# Altium schematic sheet 11_MCU.SchDoc
size 420 x 297 mm; SheetNumber: 20; SheetTotal: 33
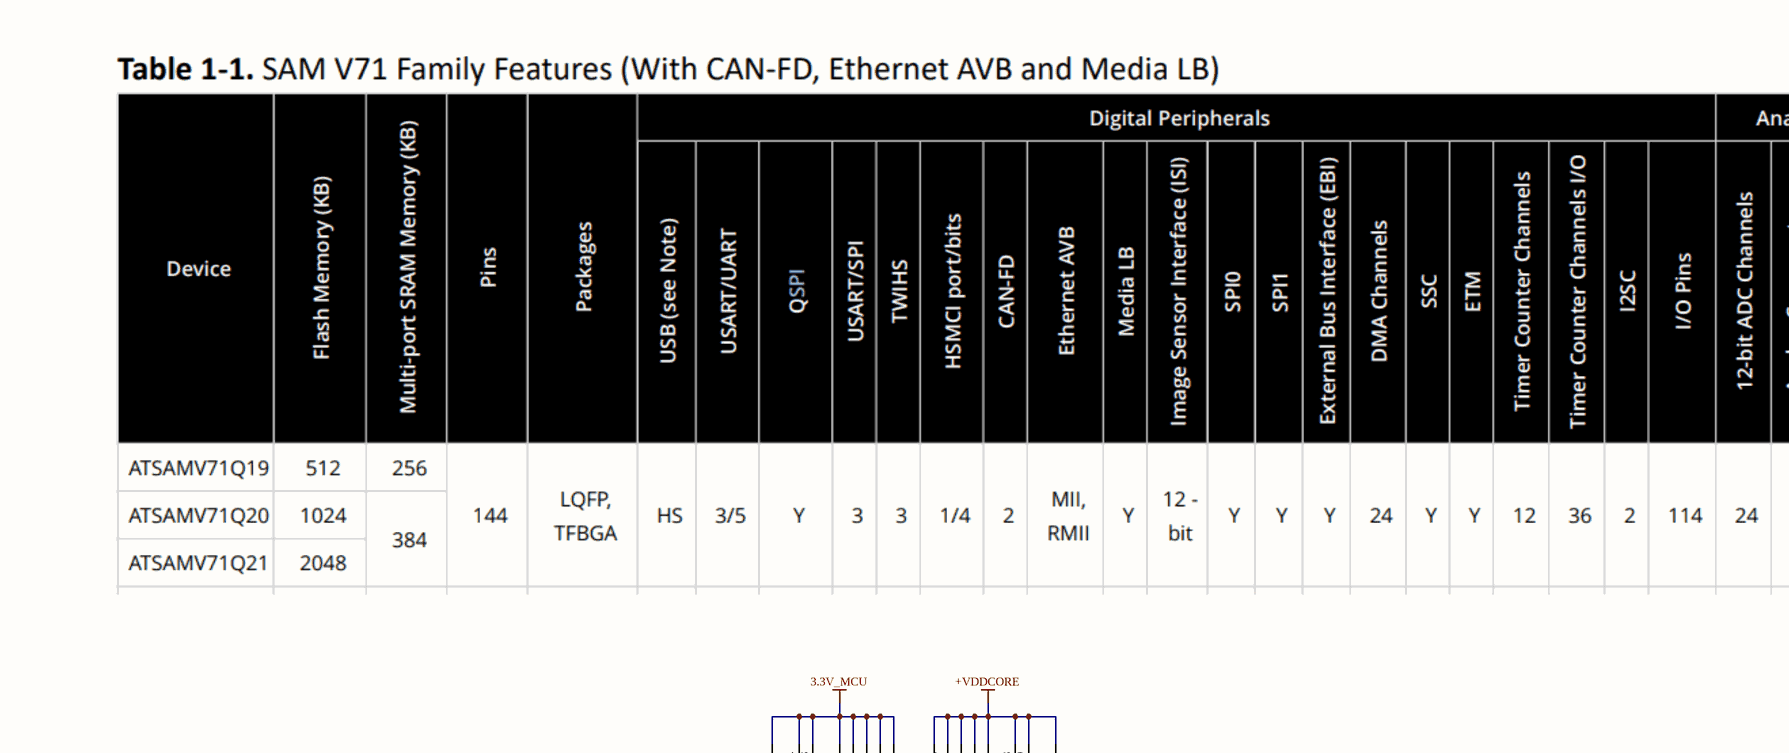
[diagram p0: 11_MCU.SchDoc, top left]
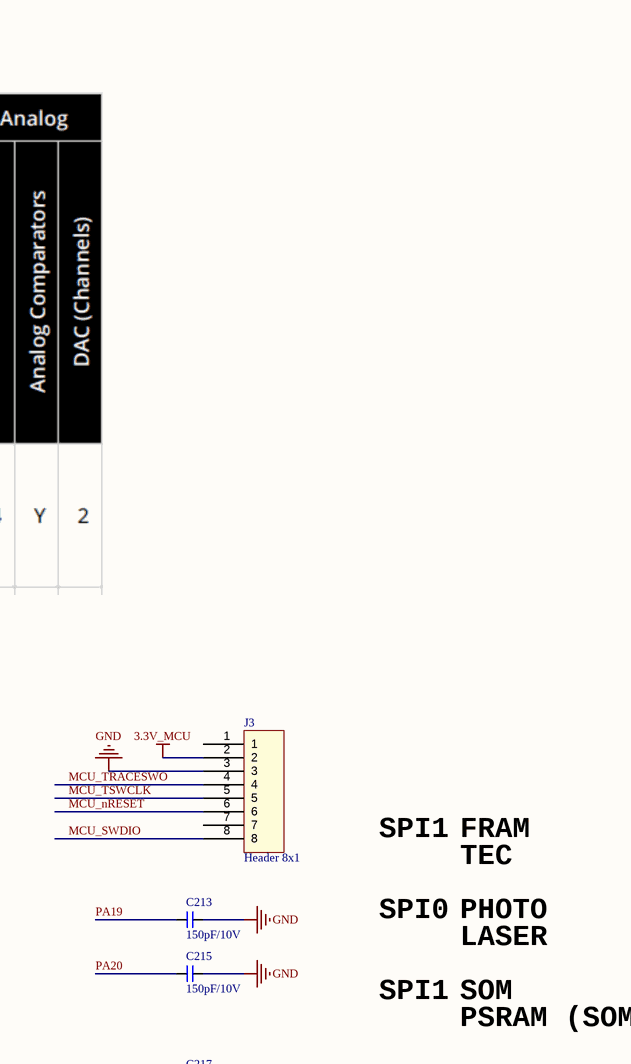
[diagram p1: 11_MCU.SchDoc, top right]
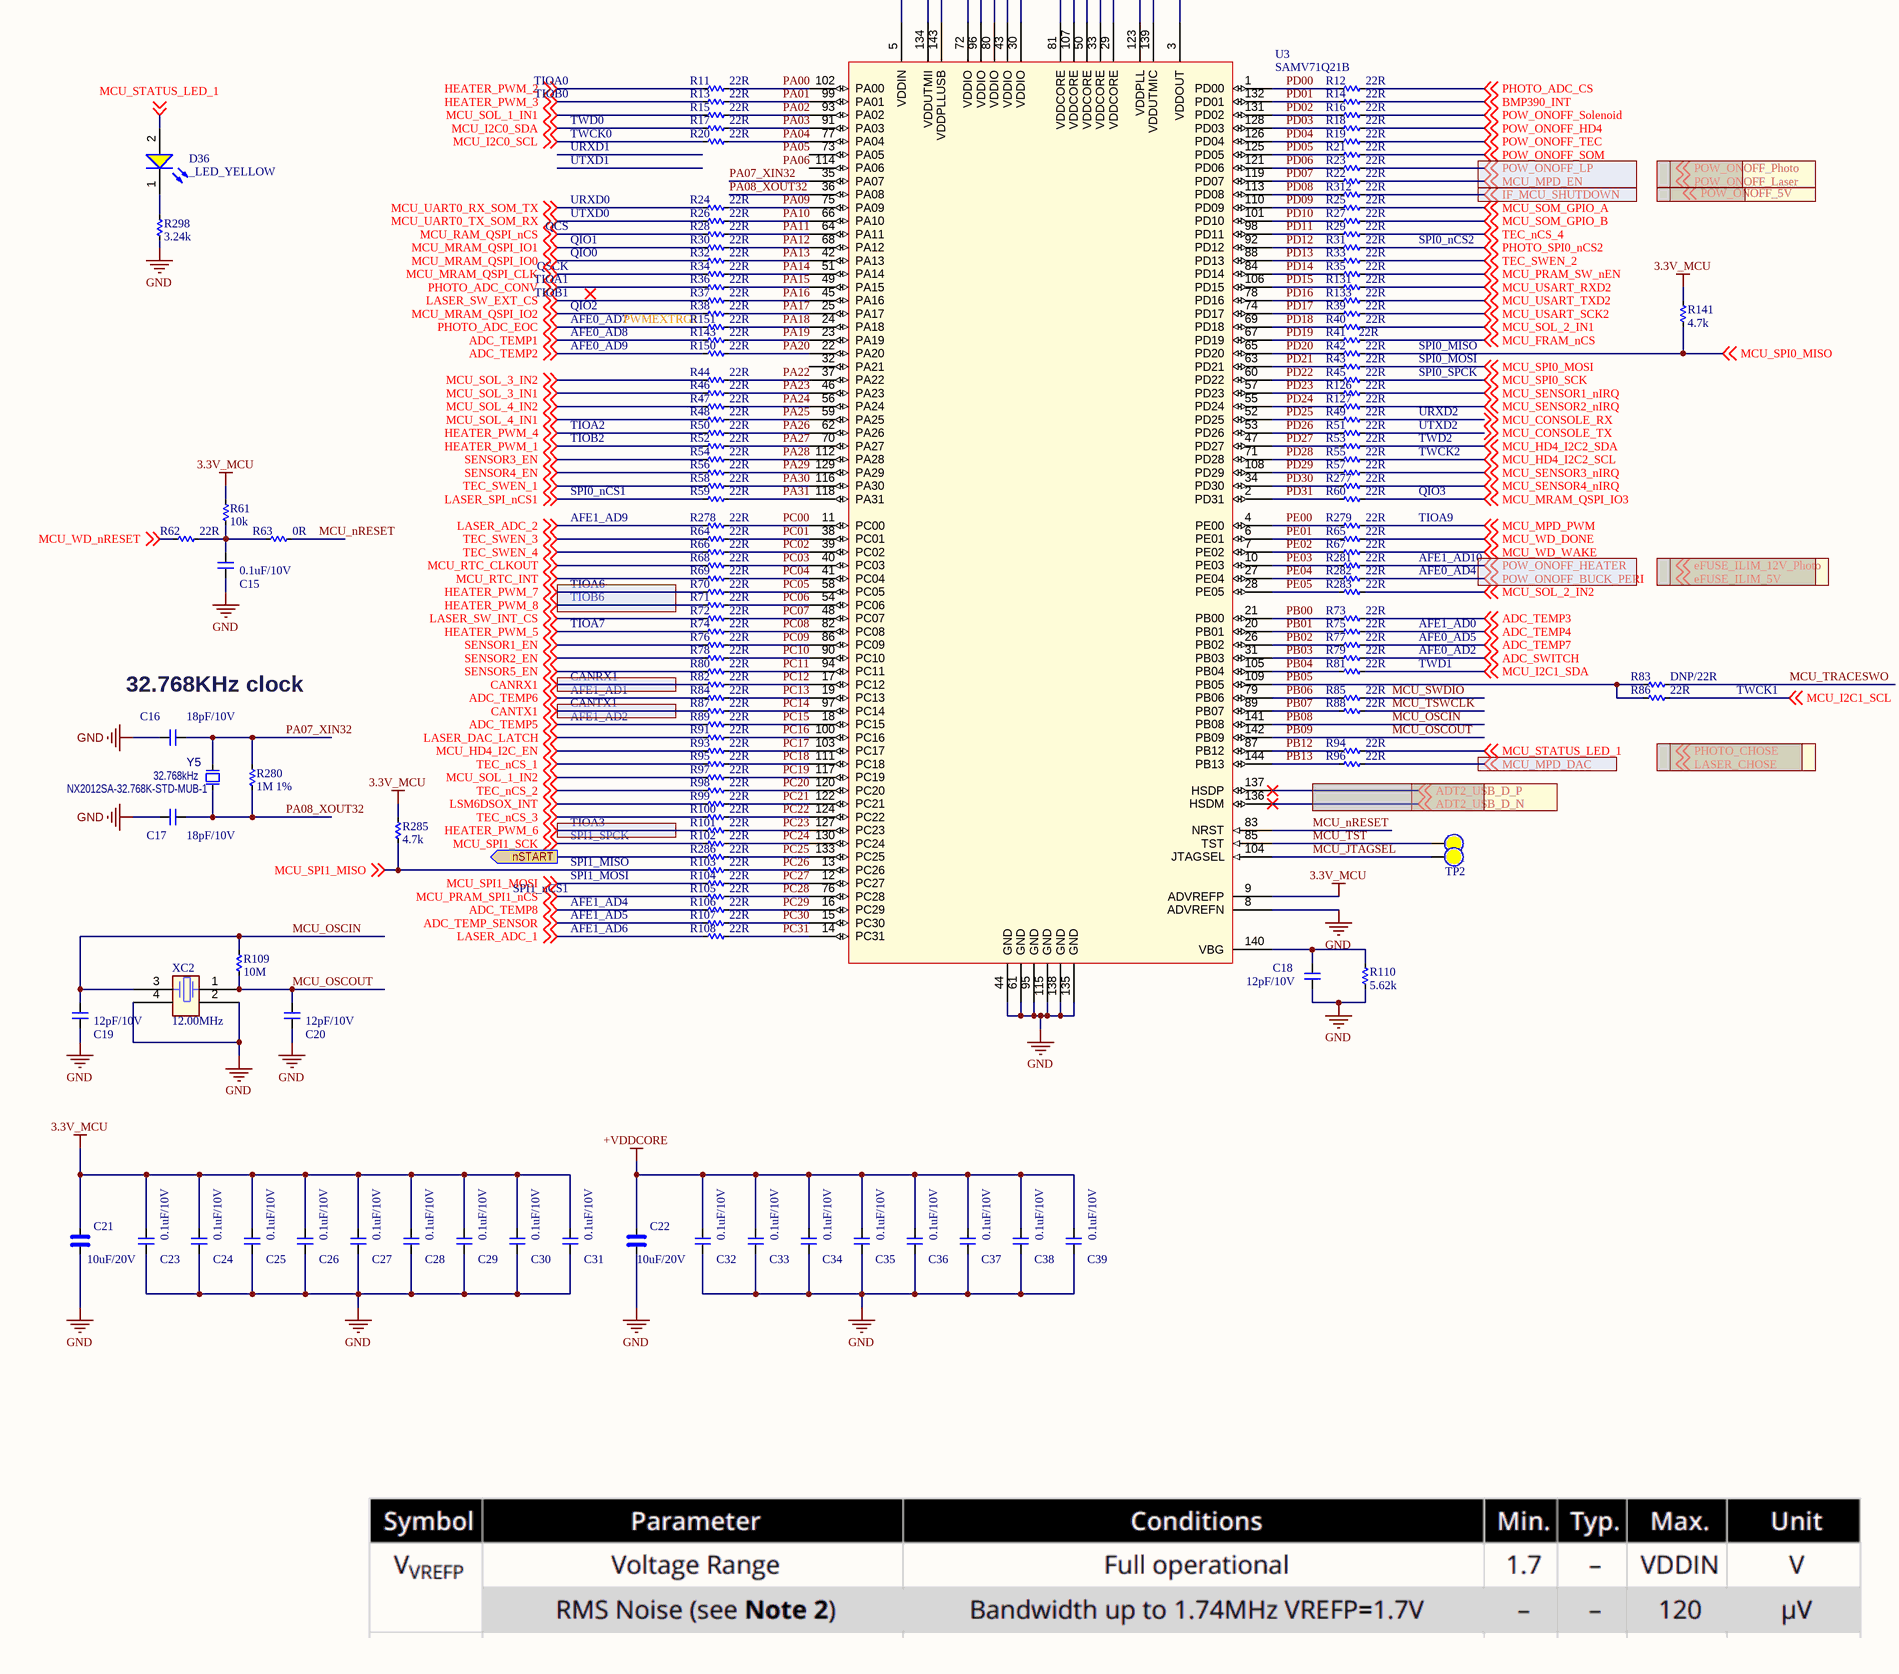
[diagram p2: 11_MCU.SchDoc, bottom left]
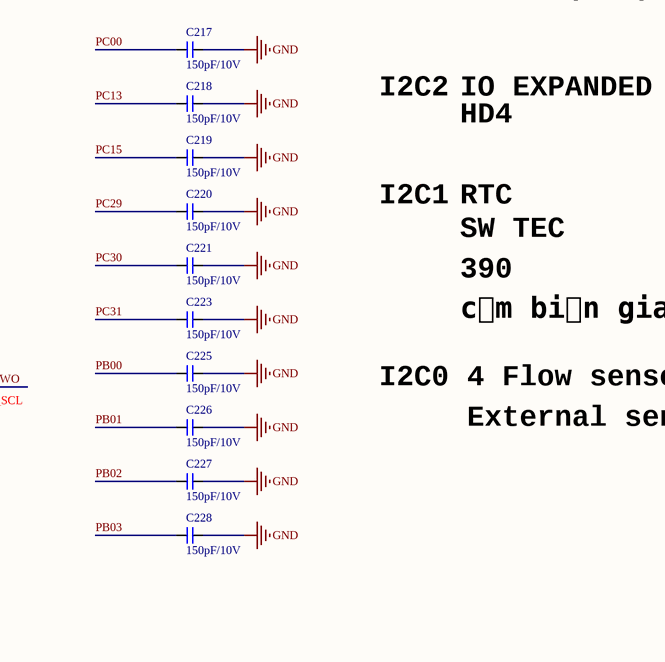
[diagram p3: 11_MCU.SchDoc, bottom right]

## Parts
C15  0.1uF/10V  [CAP_C_1005X50_L]
C16  18pF/10V  [CAP_C_0603x30]
C17  18pF/10V  [CAP_C_0603x30]
C18  12pF/10V  [CAP_C_1005X50_L]
C19  12pF/10V  [CAP_C_1005X50_L]
C20  12pF/10V  [CAP_C_1005X50_L]
C21  10uF/20V  [CAP_C_2012X110]
C22  10uF/20V  [CAP_C_2012X110]
C23  0.1uF/10V  [CAP_C_1005X50_L]
C24  0.1uF/10V  [CAP_C_1005X50_L]
C25  0.1uF/10V  [CAP_C_1005X50_L]
C26  0.1uF/10V  [CAP_C_1005X50_L]
C27  0.1uF/10V  [CAP_C_1005X50_L]
C28  0.1uF/10V  [CAP_C_1005X50_L]
C29  0.1uF/10V  [CAP_C_1005X50_L]
C30  0.1uF/10V  [CAP_C_1005X50_L]
C31  0.1uF/10V  [CAP_C_1005X50_L]
C32  0.1uF/10V  [CAP_C_1005X50_L]
C33  0.1uF/10V  [CAP_C_1005X50_L]
C34  0.1uF/10V  [CAP_C_1005X50_L]
C35  0.1uF/10V  [CAP_C_1005X50_L]
C36  0.1uF/10V  [CAP_C_1005X50_L]
C37  0.1uF/10V  [CAP_C_1005X50_L]
C38  0.1uF/10V  [CAP_C_1005X50_L]
C39  0.1uF/10V  [CAP_C_1005X50_L]
C213  150pF/10V  [CAP_C_0603x30]
C215  150pF/10V  [CAP_C_0603x30]
C217  150pF/10V  [CAP_C_0603x30]
C218  150pF/10V  [CAP_C_0603x30]
C219  150pF/10V  [CAP_C_0603x30]
C220  150pF/10V  [CAP_C_0603x30]
C221  150pF/10V  [CAP_C_0603x30]
C223  150pF/10V  [CAP_C_0603x30]
C225  150pF/10V  [CAP_C_0603x30]
C226  150pF/10V  [CAP_C_0603x30]
C227  150pF/10V  [CAP_C_0603x30]
C228  150pF/10V  [CAP_C_0603x30]
D36  _LED_YELLOW  [LED_0402]
J3  Header 8x1  [SAMTEC_TSM-108-01-L-SV-P-TR]
R11  22R  [RES_C_0603X30]
R12  22R  [RES_C_0603X30]
R13  22R  [RES_C_0603X30]
R14  22R  [RES_C_0603X30]
R15  22R  [RES_C_0603X30]
R16  22R  [RES_C_0603X30]
R17  22R  [RES_C_0603X30]
R18  22R  [RES_C_0603X30]
R19  22R  [RES_C_0603X30]
R20  22R  [RES_C_0603X30]
R21  22R  [RES_C_0603X30]
R22  22R  [RES_C_0603X30]
R23  22R  [RES_C_0603X30]
R24  22R  [RES_C_0603X30]
R25  22R  [RES_C_0603X30]
R26  22R  [RES_C_0603X30]
R27  22R  [RES_C_0603X30]
R28  22R  [RES_C_0603X30]
R29  22R  [RES_C_0603X30]
R30  22R  [RES_C_0603X30]
R31  22R  [RES_C_0603X30]
R32  22R  [RES_C_0603X30]
R33  22R  [RES_C_0603X30]
R34  22R  [RES_C_0603X30]
R35  22R  [RES_C_0603X30]
R36  22R  [RES_C_0603X30]
R37  22R  [RES_C_0603X30]
R38  22R  [RES_C_0603X30]
R39  22R  [RES_C_0603X30]
R40  22R  [RES_C_0603X30]
R41  22R  [RES_C_0603X30]
R42  22R  [RES_C_0603X30]
R43  22R  [RES_C_0603X30]
R44  22R  [RES_C_0603X30]
R45  22R  [RES_C_0603X30]
R46  22R  [RES_C_0603X30]
R47  22R  [RES_C_0603X30]
R48  22R  [RES_C_0603X30]
R49  22R  [RES_C_0603X30]
R50  22R  [RES_C_0603X30]
R51  22R  [RES_C_0603X30]
R52  22R  [RES_C_0603X30]
R53  22R  [RES_C_0603X30]
R54  22R  [RES_C_0603X30]
R55  22R  [RES_C_0603X30]
R56  22R  [RES_C_0603X30]
R57  22R  [RES_C_0603X30]
R58  22R  [RES_C_0603X30]
R59  22R  [RES_C_0603X30]
R60  22R  [RES_C_0603X30]
R61  10k  [RES_C_1005x30_L]
R62  22R  [RES_C_1005x30_L]
R63  0R  [RES_C_0603X30]
R64  22R  [RES_C_0603X30]
R65  22R  [RES_C_0603X30]
R66  22R  [RES_C_0603X30]
R67  22R  [RES_C_0603X30]
R68  22R  [RES_C_0603X30]
R69  22R  [RES_C_0603X30]
R70  22R  [RES_C_0603X30]
R71  22R  [RES_C_0603X30]
R72  22R  [RES_C_0603X30]
R73  22R  [RES_C_0603X30]
R74  22R  [RES_C_0603X30]
R75  22R  [RES_C_0603X30]
R76  22R  [RES_C_0603X30]
R77  22R  [RES_C_0603X30]
R78  22R  [RES_C_0603X30]
R79  22R  [RES_C_0603X30]
R80  22R  [RES_C_0603X30]
R81  22R  [RES_C_0603X30]
R82  22R  [RES_C_0603X30]
R83  DNP/22R  [RES_C_0603X30]
R84  22R  [RES_C_0603X30]
R85  22R  [RES_C_0603X30]
R86  22R  [RES_C_0603X30]
R87  22R  [RES_C_0603X30]
R88  22R  [RES_C_0603X30]
R89  22R  [RES_C_0603X30]
R91  22R  [RES_C_0603X30]
R93  22R  [RES_C_0603X30]
R94  22R  [RES_C_0603X30]
R95  22R  [RES_C_0603X30]
R96  22R  [RES_C_0603X30]
R97  22R  [RES_C_0603X30]
R98  22R  [RES_C_0603X30]
R99  22R  [RES_C_0603X30]
R100  22R  [RES_C_0603X30]
R101  22R  [RES_C_0603X30]
R102  22R  [RES_C_0603X30]
R103  22R  [RES_C_0603X30]
R104  22R  [RES_C_0603X30]
R105  22R  [RES_C_0603X30]
R106  22R  [RES_C_0603X30]
R107  22R  [RES_C_0603X30]
R108  22R  [RES_C_0603X30]
R109  10M  [RES_C_1005x30_L]
R110  5.62k  [RES_C_1005x30_L]
R126  22R  [RES_C_0603X30]
R127  22R  [RES_C_0603X30]
R131  22R  [RES_C_0603X30]
R133  22R  [RES_C_0603X30]
R141  4.7k  [RES_C_0603X30]
R143  22R  [RES_C_0603X30]
R150  22R  [RES_C_0603X30]
R151  22R  [RES_C_0603X30]
R277  22R  [RES_C_0603X30]
R278  22R  [RES_C_0603X30]
R279  22R  [RES_C_0603X30]
R280  1M 1%  [RES_C_1005x30_L]
R281  22R  [RES_C_0603X30]
R282  22R  [RES_C_0603X30]
R283  22R  [RES_C_0603X30]
R285  4.7k  [RES_C_0603X30]
R286  22R  [RES_C_0603X30]
R298  3.24k  [RES_C_1005x30_L]
R312  22R  [RES_C_0603X30]
TP1  (no value)  [TP_1mm_SMD]  (no BOM)
TP2  (no value)  [TP_1mm_SMD]  (no BOM)
U3  SAMV71Q21B  [AP6-00118]
XC2  value 12.00MHz  [AP7-00039]  (hidden comment: FC5BQCCMC12.0-T1)
Y5  value 32.768kHz  Manufacturer Part Number 1: NX2012SA-32.768K-STD-MUB-1  [CRYSTAL_NX2012SA]  (hidden comment: Crystal 2 Pins)

## Ports
nSTART (out)

## Nets
3.3V_MCU: C21.1 C23.2 C24.2 C25.2 C26.2 C27.2 C28.2 C29.2 C30.2 C31.2 J3.2 R61.2 R141.1 R285.1 U3.5(VDDIN) U3.9(ADVREFP) U3.30(VDDIO) U3.43(VDDIO) U3.72(VDDIO) U3.80(VDDIO) U3.96(VDDIO) U3.134(VDDUTMII) U3.143(VDDPLLUSB)
+VDDCORE: C22.1 C32.2 C33.2 C34.2 C35.2 C36.2 C37.2 C38.2 C39.2 U3.3(VDDOUT) U3.29(VDDCORE) U3.33(VDDCORE) U3.50(VDDCORE) U3.81(VDDCORE) U3.107(VDDCORE) U3.123(VDDPLL) U3.139(VDDUTMIC)
GND: C15.1 C16.2 C17.2 C18.1 C19.1 C20.1 C21.2 C22.2 C23.1 C24.1 C25.1 C26.1 C27.1 C28.1 C29.1 C30.1 C31.1 C32.1 C33.1 C34.1 C35.1 C36.1 C37.1 C38.1 C39.1 C213.1 C215.1 C217.1 C218.1 C219.1 C220.1 C221.1 C223.1 C225.1 C226.1 C227.1 C228.1 J3.3 R110.1 R298.2 U3.8(ADVREFN) U3.44(GND) U3.61(GND) U3.95(GND) U3.115(GND) U3.135(GND) U3.138(GND) XC2.2 XC2.4
ADC_SWITCH: R79.1 ; off-sheet ADC_SWITCH
ADC_TEMP1: R143.2 ; off-sheet ADC_TEMP1
ADC_TEMP2: R150.2 ; off-sheet ADC_TEMP2
ADC_TEMP3: R73.1 ; off-sheet ADC_TEMP3
ADC_TEMP4: R75.1 ; off-sheet ADC_TEMP4
ADC_TEMP5: R89.2 ; off-sheet ADC_TEMP5
ADC_TEMP6: R84.2 ; off-sheet ADC_TEMP6
ADC_TEMP7: R77.1 ; off-sheet ADC_TEMP7
ADC_TEMP8: R106.2 ; off-sheet ADC_TEMP8
ADC_TEMP_SENSOR: R107.2 ; off-sheet ADC_TEMP_SENSOR
BMP390_INT: R14.1 ; off-sheet BMP390_INT
CANRX1: R82.2 ; off-sheet CANRX1
CANTX1: R87.2 ; off-sheet CANTX1
HEATER_PWM_1: R52.2 ; off-sheet HEATER_PWM_1
HEATER_PWM_2: R11.2 ; off-sheet HEATER_PWM_2
HEATER_PWM_3: R13.2 ; off-sheet HEATER_PWM_3
HEATER_PWM_4: R50.2 ; off-sheet HEATER_PWM_4
HEATER_PWM_5: R74.2 ; off-sheet HEATER_PWM_5
HEATER_PWM_6: R101.2 ; off-sheet HEATER_PWM_6
HEATER_PWM_7: R70.2 ; off-sheet HEATER_PWM_7
HEATER_PWM_8: R71.2 ; off-sheet HEATER_PWM_8
IF_MCU_SHUTDOWN: R312.1 ; off-sheet IF_MCU_SHUTDOWN
LASER_ADC_1: R108.2 ; off-sheet LASER_ADC_1
LASER_ADC_2: R278.2 ; off-sheet LASER_ADC_2
LASER_DAC_LATCH: R91.2 ; off-sheet LASER_DAC_LATCH
LASER_SPI_nCS1: R59.2 ; off-sheet LASER_SPI_nCS1
LASER_SW_EXT_CS: R37.2 ; off-sheet LASER_SW_EXT_CS
LASER_SW_INT_CS: R72.2 ; off-sheet LASER_SW_INT_CS
LSM6DSOX_INT: R99.2 ; off-sheet LSM6DSOX_INT
MCU_CONSOLE_RX: R49.1 ; off-sheet MCU_CONSOLE_RX
MCU_CONSOLE_TX: R51.1 ; off-sheet MCU_CONSOLE_TX
MCU_FRAM_nCS: R41.2 ; off-sheet MCU_FRAM_nCS
MCU_HD4_I2C2_SCL: R55.1 ; off-sheet MCU_HD4_I2C2_SCL
MCU_HD4_I2C2_SDA: R53.1 ; off-sheet MCU_HD4_I2C2_SDA
MCU_HD4_I2C_EN: R93.2 ; off-sheet MCU_HD4_I2C_EN
MCU_I2C0_SCL: R20.2 ; off-sheet MCU_I2C0_SCL
MCU_I2C0_SDA: R17.2 ; off-sheet MCU_I2C0_SDA
MCU_I2C1_SCL: R86.1 ; off-sheet MCU_I2C1_SCL
MCU_I2C1_SDA: R81.1 ; off-sheet MCU_I2C1_SDA
MCU_JTAGSEL: TP2.0 U3.104(JTAGSEL)
MCU_MPD_DAC: R96.1 ; off-sheet MCU_MPD_DAC
MCU_MPD_EN: R22.1 ; off-sheet MCU_MPD_EN
MCU_MPD_PWM: R279.1 ; off-sheet MCU_MPD_PWM
MCU_MRAM_QSPI_CLK: R34.2 ; off-sheet MCU_MRAM_QSPI_CLK
MCU_MRAM_QSPI_IO0: R32.2 ; off-sheet MCU_MRAM_QSPI_IO0
MCU_MRAM_QSPI_IO1: R30.2 ; off-sheet MCU_MRAM_QSPI_IO1
MCU_MRAM_QSPI_IO2: R38.2 ; off-sheet MCU_MRAM_QSPI_IO2
MCU_MRAM_QSPI_IO3: R60.1 ; off-sheet MCU_MRAM_QSPI_IO3
MCU_nRESET: J3.6 R63.1 U3.83(NRST)
MCU_OSCIN: C19.2 R109.2 U3.141(PB08) XC2.3  [also labelled PB08]
MCU_OSCOUT: C20.2 R109.1 U3.142(PB09) XC2.1  [also labelled PB09]
MCU_PRAM_SPI1_nCS: R105.2 ; off-sheet MCU_PRAM_SPI1_nCS
MCU_PRAM_SW_nEN: R35.1 ; off-sheet MCU_PRAM_SW_nEN
MCU_RAM_QSPI_nCS: R28.2 ; off-sheet MCU_RAM_QSPI_nCS
MCU_RTC_CLKOUT: R68.2 ; off-sheet MCU_RTC_CLKOUT
MCU_RTC_INT: R69.2 ; off-sheet MCU_RTC_INT
MCU_SENSOR1_nIRQ: R126.1 ; off-sheet MCU_SENSOR1_nIRQ
MCU_SENSOR2_nIRQ: R127.1 ; off-sheet MCU_SENSOR2_nIRQ
MCU_SENSOR3_nIRQ: R57.2 ; off-sheet MCU_SENSOR3_nIRQ
MCU_SENSOR4_nIRQ: R277.2 ; off-sheet MCU_SENSOR4_nIRQ
MCU_SOL_1_IN1: R15.2 ; off-sheet MCU_SOL_1_IN1
MCU_SOL_1_IN2: R97.2 ; off-sheet MCU_SOL_1_IN2
MCU_SOL_2_IN1: R40.1 ; off-sheet MCU_SOL_2_IN1
MCU_SOL_2_IN2: R283.1 ; off-sheet MCU_SOL_2_IN2
MCU_SOL_3_IN1: R46.2 ; off-sheet MCU_SOL_3_IN1
MCU_SOL_3_IN2: R44.2 ; off-sheet MCU_SOL_3_IN2
MCU_SOL_4_IN1: R48.2 ; off-sheet MCU_SOL_4_IN1
MCU_SOL_4_IN2: R47.2 ; off-sheet MCU_SOL_4_IN2
MCU_SOM_GPIO_A: R25.1 ; off-sheet MCU_SOM_GPIO_A
MCU_SOM_GPIO_B: R27.1 ; off-sheet MCU_SOM_GPIO_B
MCU_SPI0_MISO: R42.1 R141.2 ; off-sheet MCU_SPI0_MISO
MCU_SPI0_MOSI: R43.1 ; off-sheet MCU_SPI0_MOSI
MCU_SPI0_SCK: R45.1 ; off-sheet MCU_SPI0_SCK
MCU_SPI1_MISO: R103.2 R285.2 ; off-sheet MCU_SPI1_MISO
MCU_SPI1_MOSI: R104.2 ; off-sheet MCU_SPI1_MOSI
MCU_SPI1_SCK: R102.2 ; off-sheet MCU_SPI1_SCK
MCU_STATUS_LED_1: D36.2(A) R94.1 ; off-sheet MCU_STATUS_LED_1
MCU_SWDIO: J3.8 R85.1
MCU_TRACESWO: J3.4 R83.1
MCU_TST: TP1.0 U3.85(TST)
MCU_TSWCLK: J3.5 R88.1
MCU_UART0_RX_SOM_TX: R24.2 ; off-sheet MCU_UART0_RX_SOM_TX
MCU_UART0_TX_SOM_RX: R26.2 ; off-sheet MCU_UART0_TX_SOM_RX
MCU_USART_RXD2: R131.1 ; off-sheet MCU_USART_RXD2
MCU_USART_SCK2: R39.1 ; off-sheet MCU_USART_SCK2
MCU_USART_TXD2: R133.1 ; off-sheet MCU_USART_TXD2
MCU_WD_DONE: R65.1 ; off-sheet MCU_WD_DONE
MCU_WD_nRESET: R62.2 ; off-sheet MCU_WD_nRESET
MCU_WD_WAKE: R67.1 ; off-sheet MCU_WD_WAKE
nSTART: R286.2 ; port nSTART
PA00: R11.1 U3.102(PA00)
PA01: R13.1 U3.99(PA01)
PA02: R15.1 U3.93(PA02)
PA03: R17.1 U3.91(PA03)
PA04: R20.1 U3.77(PA04)
PA07_XIN32: C16.1 R280.1 U3.35(PA07) Y5.2(Osc2)
PA08_XOUT32: C17.1 R280.2 U3.36(PA08) Y5.1(Osc1)
PA09: R24.1 U3.75(PA09)
PA10: R26.1 U3.66(PA10)
PA11: R28.1 U3.64(PA11)
PA12: R30.1 U3.68(PA12)
PA13: R32.1 U3.42(PA13)
PA14: R34.1 U3.51(PA14)
PA15: R36.1 U3.49(PA15)
PA16: R37.1 U3.45(PA16)
PA17: R38.1 U3.25(PA17)
PA18: R151.1 U3.24(PA18)
PA19: C213.2 R143.1 U3.23(PA19)
PA20: C215.2 R150.1 U3.22(PA20)
PA22: R44.1 U3.37(PA22)
PA23: R46.1 U3.46(PA23)
PA24: R47.1 U3.56(PA24)
PA25: R48.1 U3.59(PA25)
PA26: R50.1 U3.62(PA26)
PA27: R52.1 U3.70(PA27)
PA28: R54.1 U3.112(PA28)
PA29: R56.1 U3.129(PA29)
PA30: R58.1 U3.116(PA30)
PA31: R59.1 U3.118(PA31)
PB00: C225.2 R73.2 U3.21(PB00)
PB01: C226.2 R75.2 U3.20(PB01)
PB02: C227.2 R77.2 U3.26(PB02)
PB03: C228.2 R79.2 U3.31(PB03)
PB04: R81.2 U3.105(PB04)
PB05: R83.2 R86.2 U3.109(PB05)
PB06: R85.2 U3.79(PB06)
PB07: R88.2 U3.89(PB07)
PB12: R94.2 U3.87(PB12)
PB13: R96.2 U3.144(PB13)
PC00: C217.2 R278.1 U3.11(PC00)
PC01: R64.1 U3.38(PC01)
PC02: R66.1 U3.39(PC02)
PC03: R68.1 U3.40(PC03)
PC04: R69.1 U3.41(PC04)
PC05: R70.1 U3.58(PC05)
PC06: R71.1 U3.54(PC06)
PC07: R72.1 U3.48(PC07)
PC08: R74.1 U3.82(PC08)
PC09: R76.1 U3.86(PC09)
PC10: R78.1 U3.90(PC10)
PC11: R80.1 U3.94(PC11)
PC12: R82.1 U3.17(PC12)
PC13: C218.2 R84.1 U3.19(PC13)
PC14: R87.1 U3.97(PC14)
PC15: C219.2 R89.1 U3.18(PC15)
PC16: R91.1 U3.100(PC16)
PC17: R93.1 U3.103(PC17)
PC18: R95.1 U3.111(PC18)
PC19: R97.1 U3.117(PC19)
PC20: R98.1 U3.120(PC20)
PC21: R99.1 U3.122(PC21)
PC22: R100.1 U3.124(PC22)
PC23: R101.1 U3.127(PC23)
PC24: R102.1 U3.130(PC24)
PC25: R286.1 U3.133(PC25)
PC26: R103.1 U3.13(PC26)
PC27: R104.1 U3.12(PC27)
PC28: R105.1 U3.76(PC28)
PC29: C220.2 R106.1 U3.16(PC29)
PC30: C221.2 R107.1 U3.15(PC30)
PC31: C223.2 R108.1 U3.14(PC31)
PD00: R12.2 U3.1(PD00)
PD01: R14.2 U3.132(PD01)
PD02: R16.2 U3.131(PD02)
PD03: R18.2 U3.128(PD03)
PD04: R19.2 U3.126(PD04)
PD05: R21.2 U3.125(PD05)
PD06: R23.2 U3.121(PD06)
PD07: R22.2 U3.119(PD07)
PD08: R312.2 U3.113(PD08)
PD09: R25.2 U3.110(PD09)
PD10: R27.2 U3.101(PD10)
PD11: R29.2 U3.98(PD11)
PD12: R31.2 U3.92(PD12)
PD13: R33.2 U3.88(PD13)
PD14: R35.2 U3.84(PD14)
PD15: R131.2 U3.106(PD15)
PD16: R133.2 U3.78(PD16)
PD17: R39.2 U3.74(PD17)
PD18: R40.2 U3.69(PD18)
PD19: R41.1 U3.67(PD19)
PD20: R42.2 U3.65(PD20)
PD21: R43.2 U3.63(PD21)
PD22: R45.2 U3.60(PD22)
PD23: R126.2 U3.57(PD23)
PD24: R127.2 U3.55(PD24)
PD25: R49.2 U3.52(PD25)
PD26: R51.2 U3.53(PD26)
PD27: R53.2 U3.47(PD27)
PD28: R55.2 U3.71(PD28)
PD29: R57.1 U3.108(PD29)
PD30: R277.1 U3.34(PD30)
PD31: R60.2 U3.2(PD31)
PE00: R279.2 U3.4(PE00)
PE01: R65.2 U3.6(PE01)
PE02: R67.2 U3.7(PE02)
PE03: R281.2 U3.10(PE03)
PE04: R282.2 U3.27(PE04)
PE05: R283.2 U3.28(PE05)
PHOTO_ADC_CONV: R36.2 ; off-sheet PHOTO_ADC_CONV
PHOTO_ADC_CS: R12.1 ; off-sheet PHOTO_ADC_CS
PHOTO_ADC_EOC: R151.2 ; off-sheet PHOTO_ADC_EOC
PHOTO_SPI0_nCS2: R31.1 ; off-sheet PHOTO_SPI0_nCS2
POW_ONOFF_BUCK_PERI: R282.1 ; off-sheet POW_ONOFF_BUCK_PERI
POW_ONOFF_HD4: R18.1 ; off-sheet POW_ONOFF_HD4
POW_ONOFF_HEATER: R281.1 ; off-sheet POW_ONOFF_HEATER
POW_ONOFF_LP: R23.1 ; off-sheet POW_ONOFF_LP
POW_ONOFF_Solenoid: R16.1 ; off-sheet POW_ONOFF_Solenoid
POW_ONOFF_SOM: R21.1 ; off-sheet POW_ONOFF_SOM
POW_ONOFF_TEC: R19.1 ; off-sheet POW_ONOFF_TEC
SENSOR1_EN: R76.2 ; off-sheet SENSOR1_EN
SENSOR2_EN: R78.2 ; off-sheet SENSOR2_EN
SENSOR3_EN: R54.2 ; off-sheet SENSOR3_EN
SENSOR4_EN: R56.2 ; off-sheet SENSOR4_EN
SENSOR5_EN: R80.2 ; off-sheet SENSOR5_EN
TEC_nCS_1: R95.2 ; off-sheet TEC_nCS_1
TEC_nCS_2: R98.2 ; off-sheet TEC_nCS_2
TEC_nCS_3: R100.2 ; off-sheet TEC_nCS_3
TEC_nCS_4: R29.1 ; off-sheet TEC_nCS_4
TEC_SWEN_1: R58.2 ; off-sheet TEC_SWEN_1
TEC_SWEN_2: R33.1 ; off-sheet TEC_SWEN_2
TEC_SWEN_3: R64.2 ; off-sheet TEC_SWEN_3
TEC_SWEN_4: R66.2 ; off-sheet TEC_SWEN_4
NetC15_2: C15.2 R61.1 R62.1 R63.2
NetC18_2: C18.2 R110.2 U3.140(VBG)
NetD36_1: D36.1(K) R298.1

Not connected (* = marked no-connect by the designer): J3 1 7; U3 32(PA21) 73(PA05) 114(PA06) 136(HSDM)* 137(HSDP)*

## Notes on the sheet
- TIOA0
- URXD1
- TWD0
- TWCK0
- TIOB0
- SPI1
- TEC
- FRAM
- UTXD1
- URXD0
- UTXD0
- SPI0
- PHOTO
- QIO1
- QCS
- QSCK
- QIO0
- TIOA1
- SPI0_nCS2
- LASER
- SOM
- QIO2
- AFE0_AD8
- AFE0_AD9
- AFE0_AD7
- TIOB1
- PWMEXTRG1
- SPI0_MISO
- PSRAM (SOM)
- SPI0_MOSI
- SPI0_SPCK
- URXD2
- I2C2
- IO EXPANDED
- TIOA2
- TIOB2
- TWD2
- TWCK2
- UTXD2
- HD4
- SPI0_nCS1
- AFE1_AD9
- QIO3
- TIOA9
- I2C1
- RTC
- SW TEC
- TIOA6
- TIOB6
- AFE1_AD10
- AFE0_AD4
- 390
- (near C16) 32.768KHz clock
- CANRX1
- TIOA7
- AFE0_AD2
- AFE0_AD5
- AFE1_AD0
- TWD1
- I2C0
- cảm biến gia tốc
- 4 Flow sensor
- AFE1_AD2
- AFE1_AD1
- CANTX1
- TWCK1
- External sensor
- SPI1_MISO
- SPI1_MOSI
- SPI1_SPCK
- TIOA3
- SPI1_nCS1
- AFE1_AD4
- AFE1_AD5
- AFE1_AD6
- Labels drawn without touching a wire or pin: PA05, PA06
- Project:
- BEE-1012
- Sub-system:
- SATELLITE_EXP_CONTROLLER
- Design by:
- SANG HUYNH
- BAO BUI
- Sheet title:
- Sheet
- A3
- of
- Checked by:
- Approved by:
- VU PHAM
- Revision:
- Document No:
- Size:
- Date:

## Library data of the parts
C15-C20 C23-C39 C213 C215 C217-C221 C223 C225-C228 = _CAP_C_2: CAP
C21 C22 = _CAP_C_High_2: CAP High Value
R11-R89 R91 R93-R110 R126 R127 R131 R133 R141 R143 R150 R151 R277-R283 R285 R286 R298 R312 = _RES_B_2: RES
TP1 TP2 = Test Point: Solder: NF
U3 = A06-1541: SAM 32-bit ARM Cortex-M* RISC MCU, SAMV71B Series, QFP144; PartGroup: Integrated Circuits,MCU, MPU, DSP,ARM MCU; Manufacturer: MICROCHIP; MPN: ATSAMV71Q21B-AAB; TemperatureRange: -40Â°C to +105Â°C; AN: A06-1541; Value: SAMV71Q21B; Height: 1,60000002384186
XC2 = A07-0042: Fox FQ5032B 12.0MHz SMD crystal 738B-12; PartGroup: Frequency devices,Crystals,SMD; Manufacturer: Fox  Electronics; MPN: FQ5032B-12.000; Tolerance: Â±30ppm; TemperatureRange: 0Â°C ~ 70Â°C; AN: A07-0042; Height: 1,20000004768372
Y5 = OSC_32.768kHz: Crystal; Manufacturer 1: NDK; MCHP-ID: OSC1092; Description_: CRYSTAL 32.768kHz 12.5pF SMD NX2012SA; Dev Tools Status: Production; Owner: Jamus Griego; Tolerance: ±20ppm; Load Capacitance: 12.5pF; Populated: YES; Revision: 1; Symbol: Crystal 2 Pins; Status: MCL Design; ComponentLink1URL: https://chn-vm-apps.microchip.com/mchprepo/parts/Datasheets/c_NX2012SA-STD-MUB-1_e.pdf; ComponentLink1Description: SVN Datasheet; ComponentLink2URL: C:\ALTIUM_WORK\00001_MCHP-CDB\Datasheets\c_NX2012SA-STD-MUB-1_e.pdf; ComponentLink2Description: Local Datasheet; ComponentLink3URL: C:\ALTIUM_WORK\00001_MCHP-CDB\Library\LibraryRefs\Crystal 2 Pins.SchLib; ComponentLink3Description: Open Symbol; ComponentLink4URL: C:\ALTIUM_WORK\00001_MCHP-CDB\Library\Footprints\CRYSTAL_NX2012SA.PcbLib; ComponentLink4Description: Open Footprint; ComponentLink5Description: Open Footprint 2; ComponentLink6Description: Open Footprint 3; ComponentLink7Description: Open Footprint 4; Type: Crystal; Category: Crystal/Oscillator; Supplier 1: Digi-Key; Supplier Part Number 1: 644-1219-1-ND; Quantity Override: 1